# Altium schematic sheet MCU_GPS_Comms.SchDoc
size A4; SheetNumber: 9; SheetTotal: 9
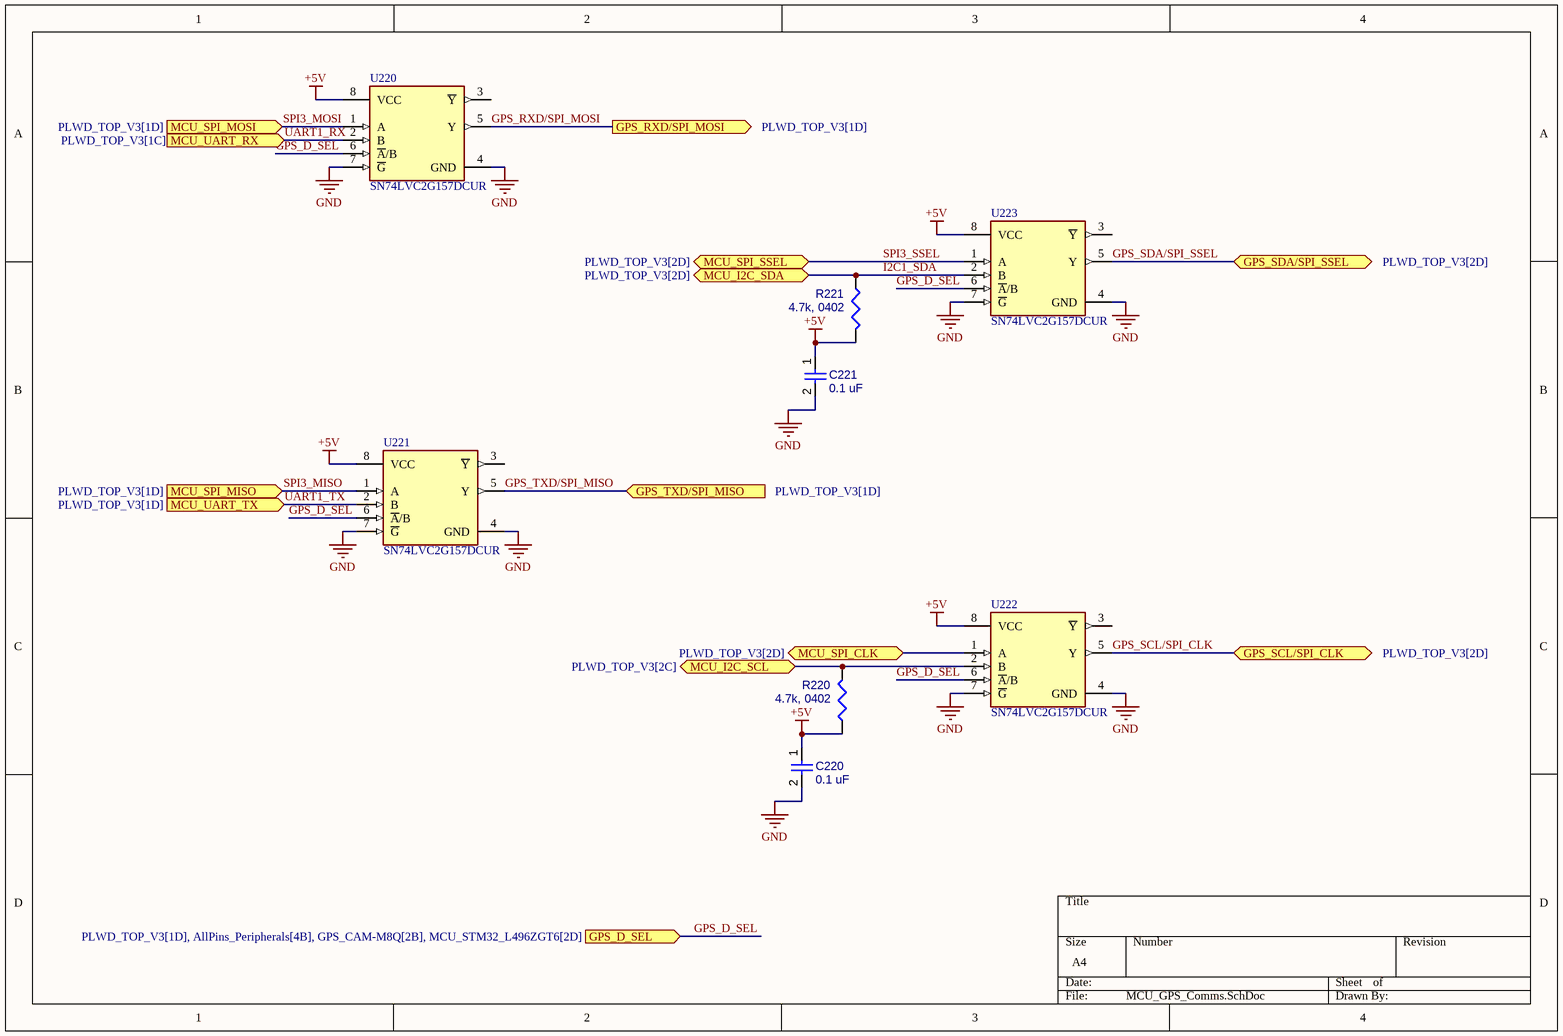
[diagram p0: MCU_GPS_Comms.SchDoc]

## Parts
C220  0.1 uF  [CAPC1005X56X25LL10T15]
C221  0.1 uF  [CAPC1005X56X25LL10T15]
R220  4.7k, 0402  [RESC0402(1005)_L]
R221  4.7k, 0402  [RESC0402(1005)_L]
U220  SN74LVC2G157DCUR  [FP-DCU0008A-MFG]
U221  SN74LVC2G157DCUR  [FP-DCU0008A-MFG]
U222  SN74LVC2G157DCUR  [FP-DCU0008A-MFG]
U223  SN74LVC2G157DCUR  [FP-DCU0008A-MFG]

## Ports
GPS_D_SEL (in, see PLWD_TOP_V3[1D], AllPins_Peripherals[4B], GPS_CAM-M8Q[2B], MCU_STM32_L496ZGT6[2D]), GPS_RXD/SPI_MOSI (out, see PLWD_TOP_V3[1D]), GPS_SCL/SPI_CLK (bidir, see PLWD_TOP_V3[2D]), GPS_SDA/SPI_SSEL (bidir, see PLWD_TOP_V3[2D]), GPS_TXD/SPI_MISO (in, see PLWD_TOP_V3[1D]), MCU_I2C_SCL (bidir, see PLWD_TOP_V3[2C]), MCU_I2C_SDA (bidir, see PLWD_TOP_V3[2D]), MCU_SPI_CLK (bidir, see PLWD_TOP_V3[2D]), MCU_SPI_MISO (in, see PLWD_TOP_V3[1D]), MCU_SPI_MOSI (in, see PLWD_TOP_V3[1D]), MCU_SPI_SSEL (bidir, see PLWD_TOP_V3[2D]), MCU_UART_RX (in, see PLWD_TOP_V3[1C]), MCU_UART_TX (in, see PLWD_TOP_V3[1D])

## Nets
+5V: C220.1 C221.1 R220.1 R221.2 U220.8(VCC) U221.8(VCC) U222.8(VCC) U223.8(VCC)
GND: C220.2 C221.2 U220.4(GND) U220.7(~{G}) U221.4(GND) U221.7(~{G}) U222.4(GND) U222.7(~{G}) U223.4(GND) U223.7(~{G})
GPS_D_SEL: U220.6(~{A}/B) U221.6(~{A}/B) U222.6(~{A}/B) U223.6(~{A}/B) ; port GPS_D_SEL
GPS_RXD/SPI_MOSI: U220.5(Y) ; port GPS_RXD/SPI_MOSI
GPS_SCL/SPI_CLK: U222.5(Y) ; port GPS_SCL/SPI_CLK
GPS_SDA/SPI_SSEL: U223.5(Y) ; port GPS_SDA/SPI_SSEL
GPS_TXD/SPI_MISO: U221.5(Y) ; port GPS_TXD/SPI_MISO
I2C1_SDA: R221.1 U223.2(B) ; port MCU_I2C_SDA
MCU_I2C_SCL: R220.2 U222.2(B) ; port MCU_I2C_SCL
MCU_SPI_CLK: U222.1(A) ; port MCU_SPI_CLK
SPI3_MISO: U221.1(A) ; port MCU_SPI_MISO
SPI3_MOSI: U220.1(A) ; port MCU_SPI_MOSI
SPI3_SSEL: U223.1(A) ; port MCU_SPI_SSEL
UART1_RX: U220.2(B) ; port MCU_UART_RX
UART1_TX: U221.2(B) ; port MCU_UART_TX

Not connected (* = marked no-connect by the designer): U220 3(~{Y}); U221 3(~{Y}); U222 3(~{Y}); U223 3(~{Y})

## Library data of the parts
C220 C221 = CMP-001-00001-6: Chip Capacitor, 0.1 uF, +/- 5%, 16 V, 0402 (1005 Metric); Value: 100nF; Capacitor Type: Ceramic; Voltage Rating: 16V; Min Operating Temperature: -55°C; Pins: 2; Case/Package: 0402; Max Operating Temperature: 125°C; Mounting Technology: SM; RoHS Compliant: True; Tolerance: 5%
R220 R221 = CMP-009-00158-3: Chip Resistor, 4,7 kOhms, +/-1 %, 63 mW, -55 to 155 degC, 0402; Power: 63mW; Tolerance: 1%; Max Operating Temperature: 155°C; Pins: 2; Value: 4.7k; Min Operating Temperature: -55°C; Case/Package: 0402
U220-U223 = CMP-0859-00708-4: IC MULTIPLEXER DATA SEL US8; Manufacturer: Texas Instruments; Number Of Outputs: 1; Nominal Supply Current: 10uA; Max Junction Temp: +150°C; Number Of Inputs: 2; Propagation Delay: 4ns; Max Supply Voltage: 5.5V; Standoff Height: 0mm; Frequency: 150MHz; Min Supply Voltage: 1.65V; Ambient Temperature Range Low: -40°C; Device Class L1: Integrated Circuits (ICs); Ambient Temperature Range High: +85°C; Temperature Range High: +85°C; Number Of Circuits: 1; Logic Function Desc: Multiplexer; Package: DCU0008A; ComponentLink2Description: Datasheet; Category: IC; Temperature Range Low: -40°C; Lead Free: Yes; ComponentLink2URL: http://www.ti.com/lit/ds/symlink/sn74lvc2g157.pdf; Device Class L3: Multiplexers; Height: 0.9mm; Automotive: No; Temperature: -40°C to +85°C; Octopart: https://octopart.com/sn74lvc2g157dcur-texas+instruments-472190; RoHS: TRUE; Digikey Description: IC MULTIPLEXER DATA SEL US8; Manufacturer Part Number: SN74LVC2G157DCUR; Device Class L2: Logic ICs; Mouser Description: Single 2-Line to 1-Line Data Selector/Multiplexer 8-VSSOP -40 to 85